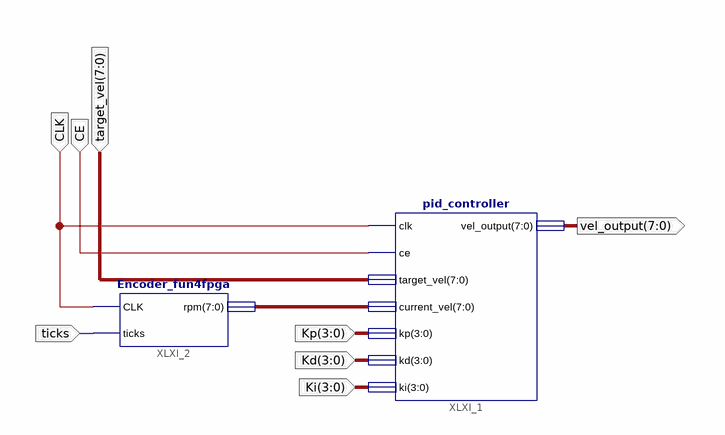
[diagram p0: schematic sheet 1]
// Xilinx ISE schematic PID_ENCODER.sch (spartan3e) as structural Verilog: 2 symbols, 8 ports
module PID_ENCODER (
  input  CLK,
  input  CE,
  input  [7:0] target_vel,
  input  ticks,
  input  [3:0] Kp,
  input  [3:0] Kd,
  input  [3:0] Ki,
  output [7:0] vel_output
);

  wire [7:0] XLXN_1;

  pid_controller XLXI_1 (
    .clk(CLK), .ce(CE), .target_vel(target_vel), .current_vel(XLXN_1), .kp(Kp), .kd(Kd), .ki(Ki),
    .vel_output(vel_output));
  Encoder_fun4fpga XLXI_2 (.CLK(CLK), .ticks(ticks), .rpm(XLXN_1));
endmodule
